# Altium schematic sheet Battery_Connections.SchDoc
size A; SheetNumber: 14; SheetTotal: 16
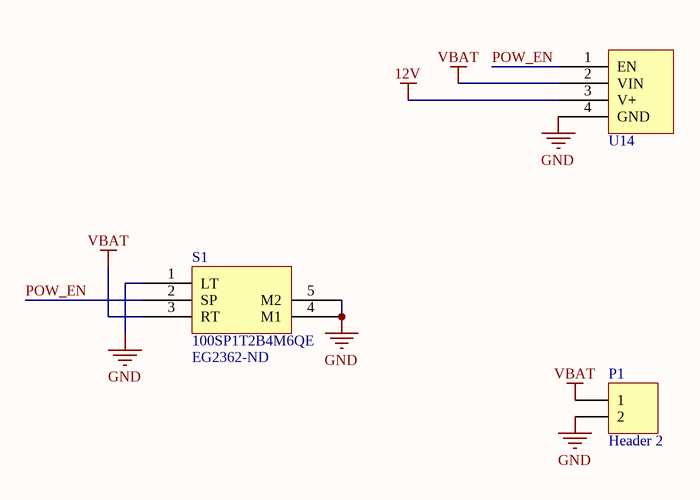
[diagram p0: Battery_Connections.SchDoc]

## Parts
P1  Header 2  [HDR1X2]
S1  100SP1T2B4M6QE  Supplier Part Number 1: EG2362-ND  [100SP1T2B4M6QE]
U14  Adafruit 12V Bias Voltage Boost Converter - TPS61040  [12V_Suppy]  (value not drawn)

## Nets
12V: U14.3(V+)
GND: P1.2 S1.1(LT) S1.4(M1) S1.5(M2) U14.4(GND)
VBAT: P1.1 S1.3(RT) U14.2(VIN)
POW_EN: S1.2(SP) U14.1(EN)

## Library data of the parts
P1 = Header 2: Header, 2-Pin; LatestRevisionDate: 17-Jul-2002; LatestRevisionNote: Re-released for DXP Platform.; Publisher: Altium Limited
U14 = 12V_Supply
S1 = 100SP1T2B4M6QE: Supplier 1: DigiKey